# EAGLE schematic iRob_Upsized_ESP32DOIT_Shield v7 (EAGLE 9.7.0)

## Sheet 1 of 2: MCU
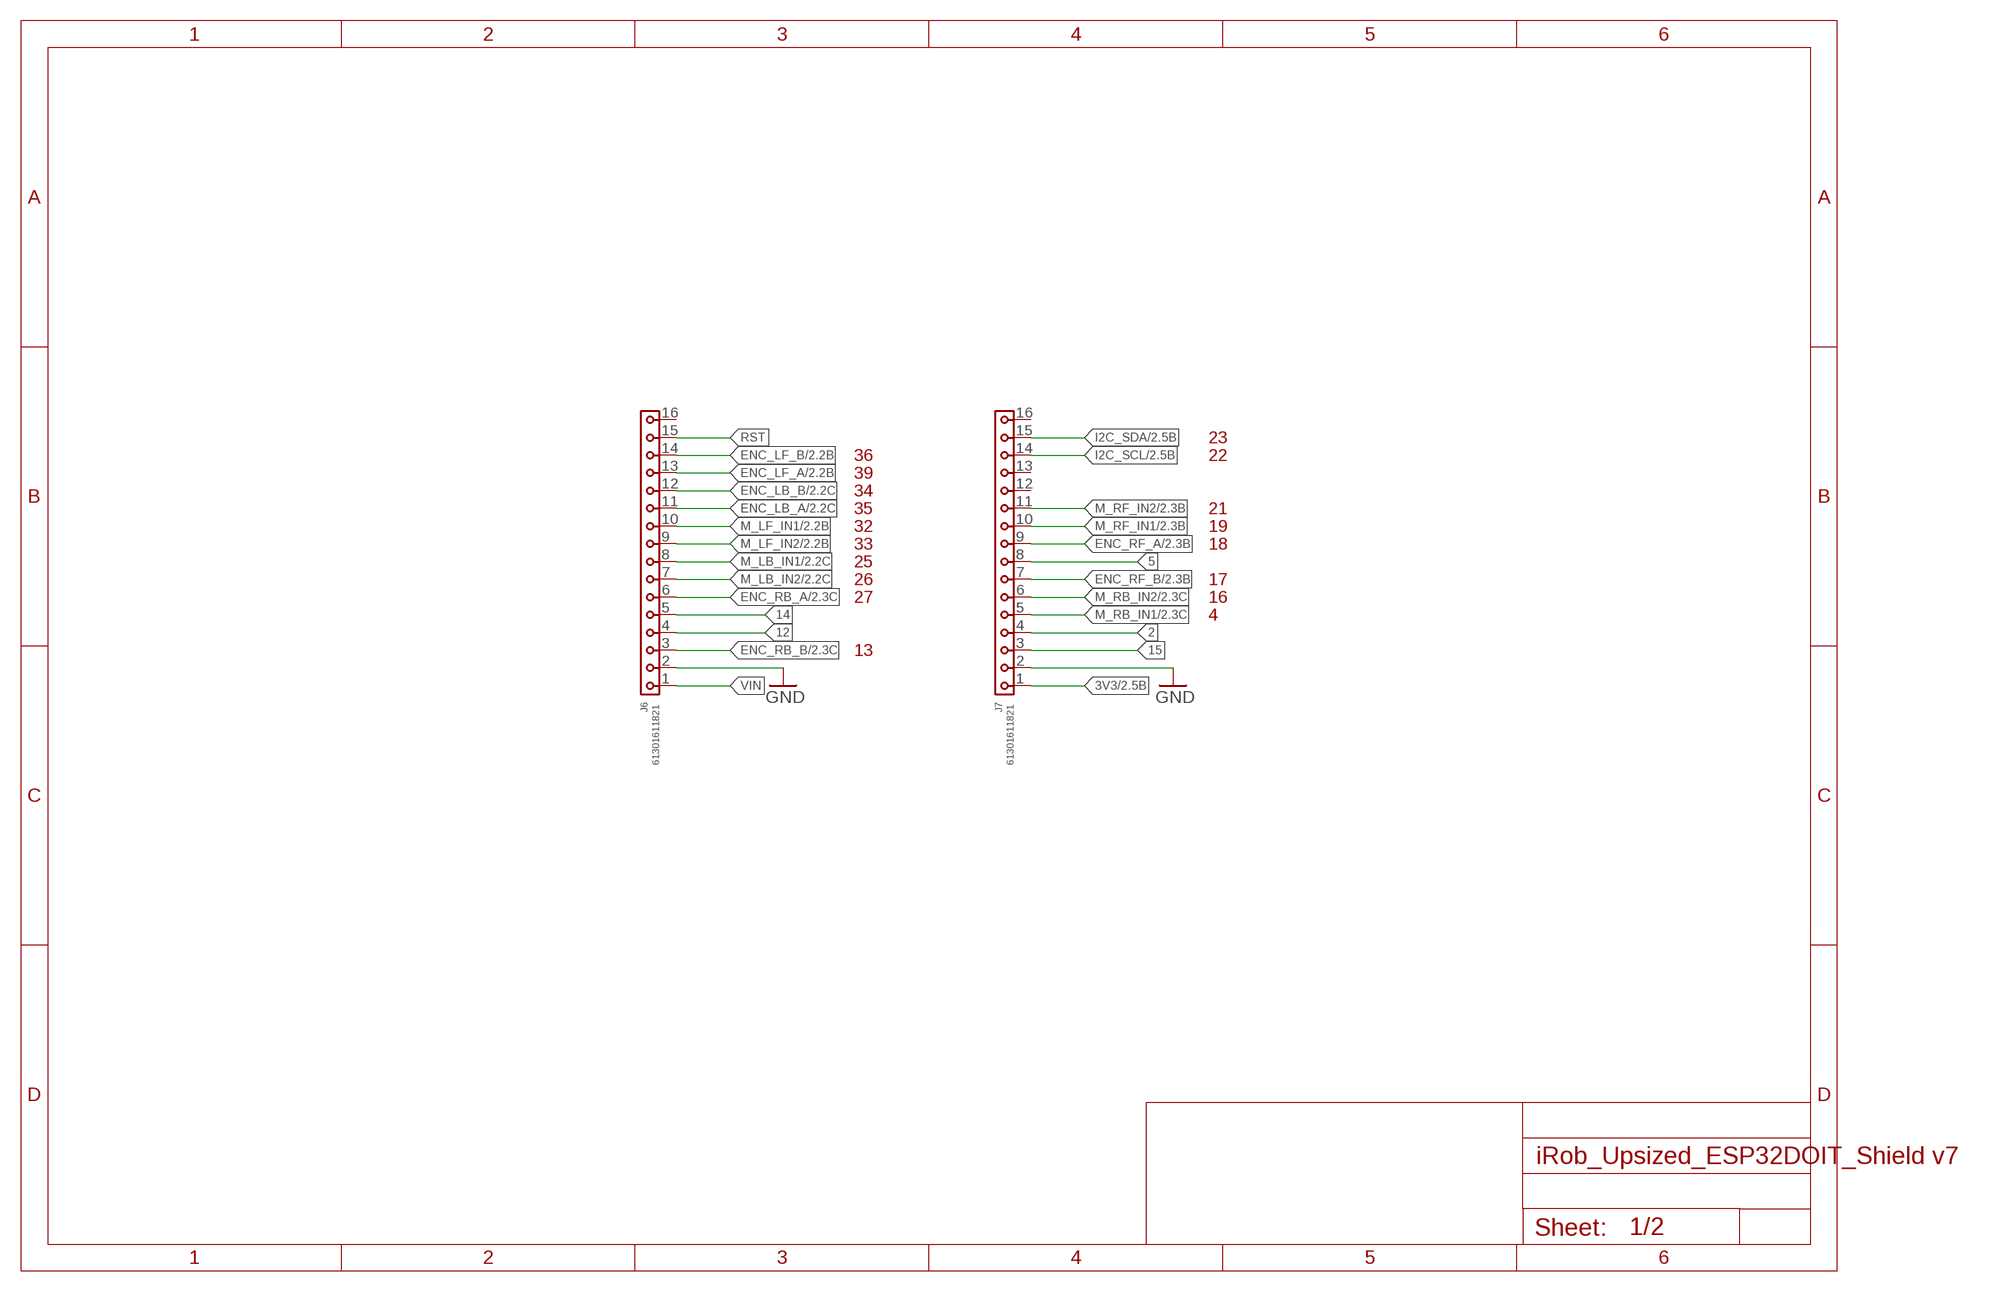
[diagram p0: schematic, sheet 1]

### Parts
J6  61301611821  6130XX11821_61301611821  [61301611821]
J7  61301611821  6130XX11821_61301611821  [61301611821]

### Nets
2: J7.4
3V3: J7.1 ; also sheet 2
5: J7.8
12: J6.4
14: J6.5
15: J7.3
ENC_LB_A: J6.11 ; also sheet 2
ENC_LB_B: J6.12 ; also sheet 2
ENC_LF_A: J6.13 ; also sheet 2
ENC_LF_B: J6.14 ; also sheet 2
ENC_RB_A: J6.6 ; also sheet 2
ENC_RB_B: J6.3 ; also sheet 2
ENC_RF_A: J7.9 ; also sheet 2
ENC_RF_B: J7.7 ; also sheet 2
GND: J6.2 J7.2 ; also sheet 2
I2C_SCL: J7.14 ; also sheet 2
I2C_SDA: J7.15 ; also sheet 2
M_LB_IN1: J6.8 ; also sheet 2
M_LB_IN2: J6.7 ; also sheet 2
M_LF_IN1: J6.10 ; also sheet 2
M_LF_IN2: J6.9 ; also sheet 2
M_RB_IN1: J7.5 ; also sheet 2
M_RB_IN2: J7.6 ; also sheet 2
M_RF_IN1: J7.10 ; also sheet 2
M_RF_IN2: J7.11 ; also sheet 2
RST: J6.15
VIN: J6.1
Unconnected: J6.16 J7.12 J7.13 J7.16

### Notes on the sheet
- 23
- 36 | 22
- 39
- 34
- 35 | 21
- 32 | 19
- 33 | 18
- 25
- 26 | 17
- 27 | 16
- 4
- 13

## Sheet 2 of 2: I/F
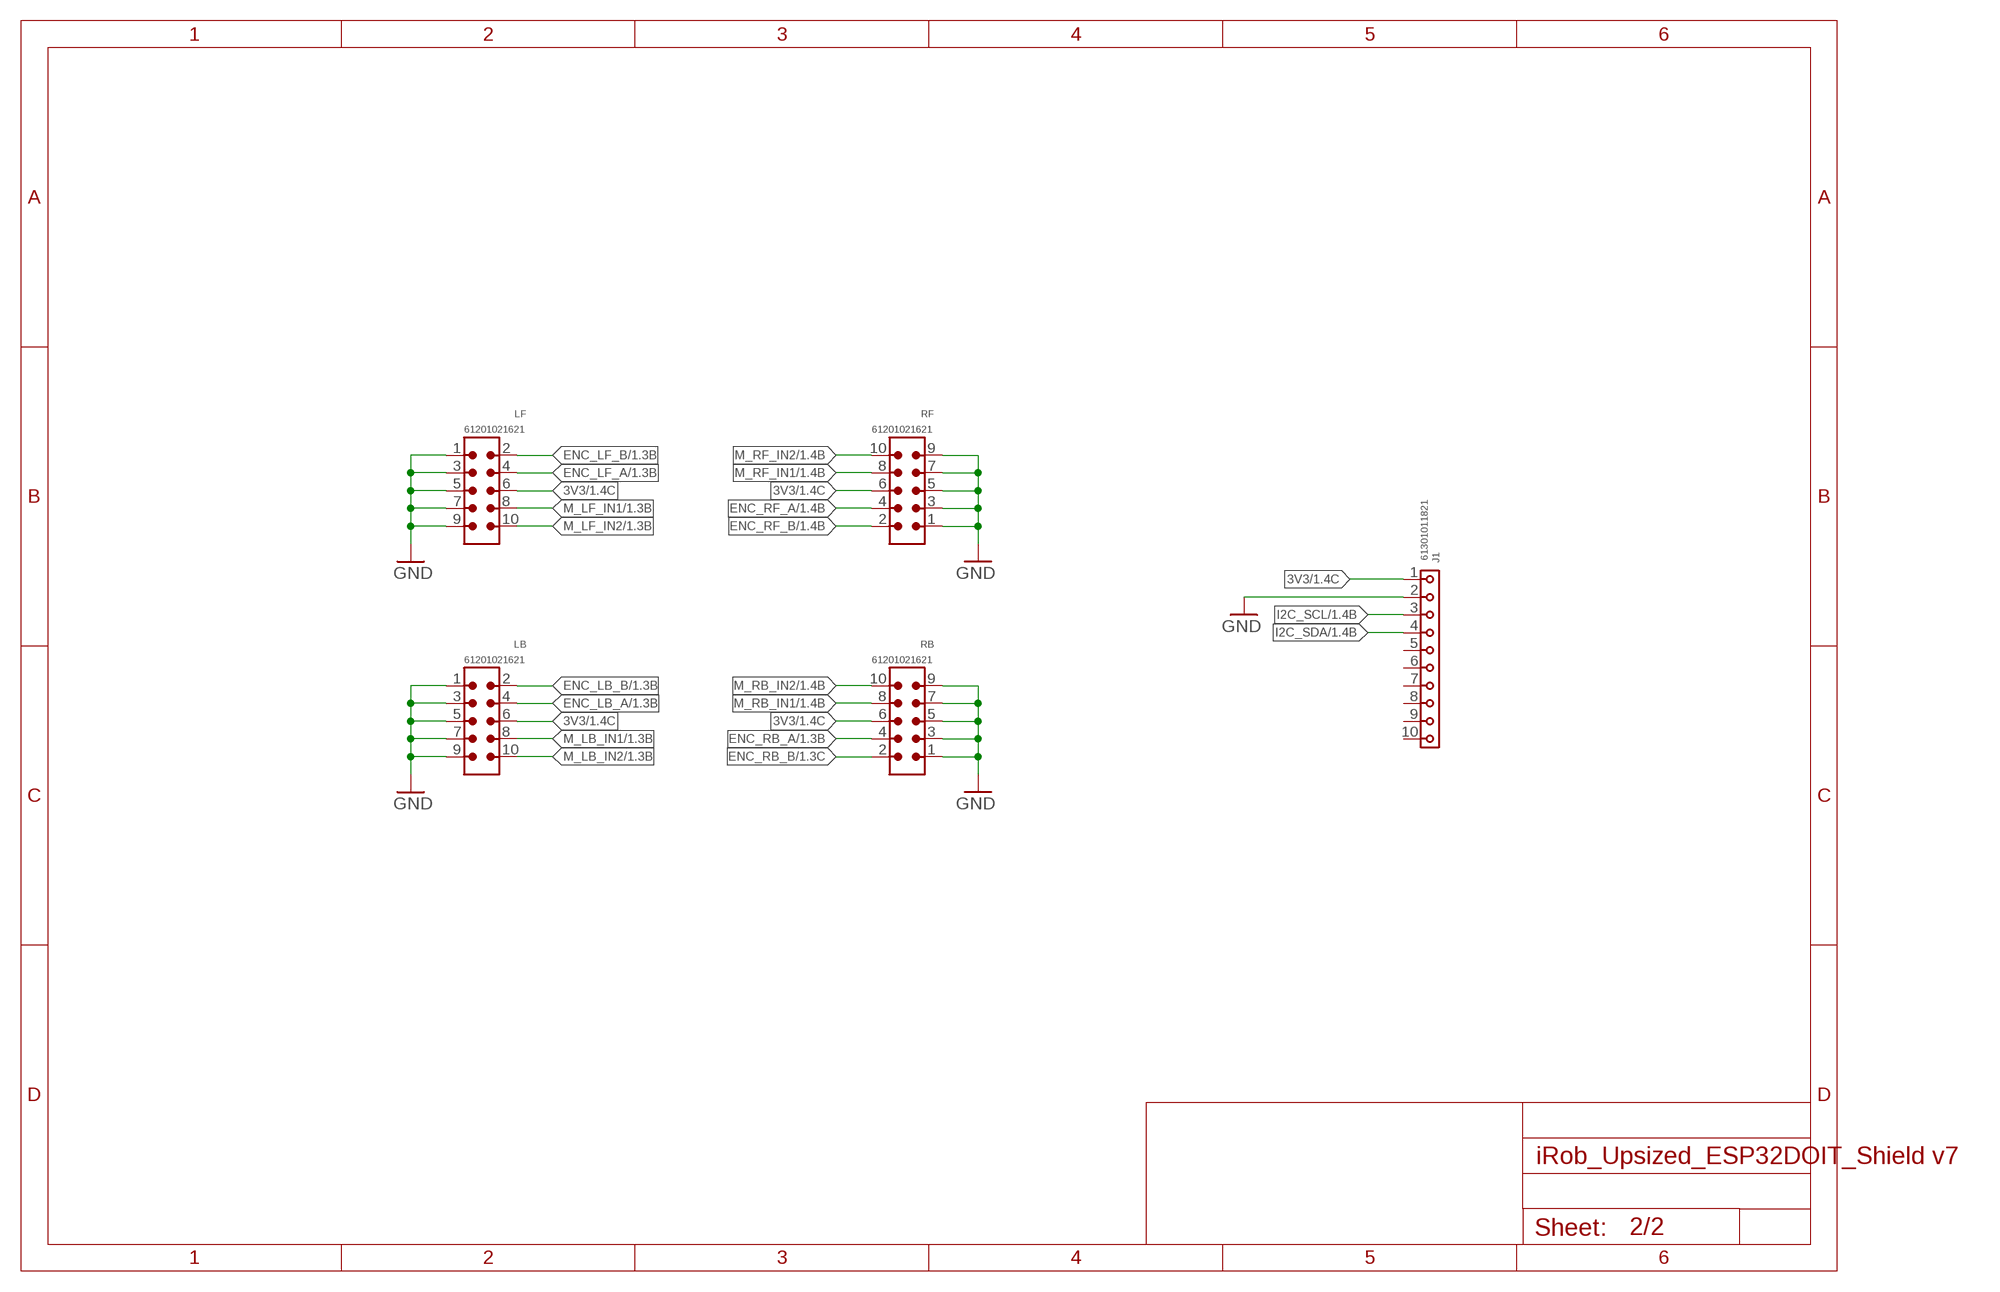
[diagram p1: schematic, sheet 2]

### Parts
J1  61301011821  6130XX11821_61301011821  [61301011821]
LB  61201021621  6120XX21621_61201021621  [61201021621]
LF  61201021621  6120XX21621_61201021621  [61201021621]
RB  61201021621  6120XX21621_61201021621  [61201021621]
RF  61201021621  6120XX21621_61201021621  [61201021621]

### Nets
3V3: J1.1 LB.6 LF.6 RB.6 RF.6 ; also sheet 1
ENC_LB_A: LB.4 ; also sheet 1
ENC_LB_B: LB.2 ; also sheet 1
ENC_LF_A: LF.4 ; also sheet 1
ENC_LF_B: LF.2 ; also sheet 1
ENC_RB_A: RB.4 ; also sheet 1
ENC_RB_B: RB.2 ; also sheet 1
ENC_RF_A: RF.4 ; also sheet 1
ENC_RF_B: RF.2 ; also sheet 1
GND: J1.2 LB.1 LB.3 LB.5 LB.7 LB.9 LF.1 LF.3 LF.5 LF.7 LF.9 RB.1 RB.3 RB.5 RB.7 RB.9 RF.1 RF.3 RF.5 RF.7 RF.9 ; also sheet 1
I2C_SCL: J1.3 ; also sheet 1
I2C_SDA: J1.4 ; also sheet 1
M_LB_IN1: LB.8 ; also sheet 1
M_LB_IN2: LB.10 ; also sheet 1
M_LF_IN1: LF.8 ; also sheet 1
M_LF_IN2: LF.10 ; also sheet 1
M_RB_IN1: RB.8 ; also sheet 1
M_RB_IN2: RB.10 ; also sheet 1
M_RF_IN1: RF.8 ; also sheet 1
M_RF_IN2: RF.10 ; also sheet 1
Unconnected: J1.5 J1.6 J1.7 J1.8 J1.9 J1.10

## Library data of the parts
J1 = Wurth_Connectors_WR-PHD:6130XX11821_61301011821: WR-PHD 2.54 mm Socket Header ARTICLE PROPERTIES: Pins:1;​ 2;​ 3;​ 4;​ 5;​ 6;​ 7;​ 8;​ 9;​ 10;​ 12;​ 13;​ 14;​ 15;​ 16;​ 18;​ 20;​ 22;​ 24;​ 25;​ 32;​ 36;​ 40 KIND PROPERTIES: Pitch：2.54 mm Quality Class:3 as per CECC 75 301-802 Rows：Single Gender：Socket Header;​ Female Type：Straight MATERIAL PROPERTIES: Insulator Material :PBT Insulator Flammability Rating:UL94 V-0 Contact Material:Copper Alloy Contact Plating:Gold Contact Type:Stamped GENERAL INFORMATION Operating Temperature:-40 up to +125 °C Compliance:Lead free / RoHS ELECTRICAL PROPERTIES: Rated Current:3 A IR 1:3 A Withstanding Voltage:500 V (AC) Contact Resistance:20 mΩ RISO:1000 MΩ CERTIFICATION UL Approval:E323964 PACKAGING PROPERTIES Packaging:Tray <https://katalog.we-online.com/media/images/v2/o33218v209%20Family_WR-PHD_613xxx11821.jpg> Details see: https://katalog.we-online.com/en/em/PHD_2_54_SOCKET_HEADER_6130XX11821 Updated by Yingchun,Shan 2019-10-21 2019 (C) Würth Elektronik; DATASHEET-URL: https://www.we-online.com/catalog/datasheet/61301011821.pdf; GENDER: Socket Header; IR: 3A; MOUNT: THT; PACKAGING: Tray; PART-NUMBER: 61301011821; PINS: 10; PITCH: 2.54mm; ROWS: Single; TYPE: Straight
J6 J7 = Wurth_Connectors_WR-PHD:6130XX11821_61301611821: WR-PHD 2.54 mm Socket Header ARTICLE PROPERTIES: Pins:1;​ 2;​ 3;​ 4;​ 5;​ 6;​ 7;​ 8;​ 9;​ 10;​ 12;​ 13;​ 14;​ 15;​ 16;​ 18;​ 20;​ 22;​ 24;​ 25;​ 32;​ 36;​ 40 KIND PROPERTIES: Pitch：2.54 mm Quality Class:3 as per CECC 75 301-802 Rows：Single Gender：Socket Header;​ Female Type：Straight MATERIAL PROPERTIES: Insulator Material :PBT Insulator Flammability Rating:UL94 V-0 Contact Material:Copper Alloy Contact Plating:Gold Contact Type:Stamped GENERAL INFORMATION Operating Temperature:-40 up to +125 °C Compliance:Lead free / RoHS ELECTRICAL PROPERTIES: Rated Current:3 A IR 1:3 A Withstanding Voltage:500 V (AC) Contact Resistance:20 mΩ RISO:1000 MΩ CERTIFICATION UL Approval:E323964 PACKAGING PROPERTIES Packaging:Tray <https://katalog.we-online.com/media/images/v2/o33218v209%20Family_WR-PHD_613xxx11821.jpg> Details see: https://katalog.we-online.com/en/em/PHD_2_54_SOCKET_HEADER_6130XX11821 Updated by Yingchun,Shan 2019-10-21 2019 (C) Würth Elektronik; DATASHEET-URL: https://www.we-online.com/catalog/datasheet/61301611821.pdf; GENDER: Socket Header; IR: 3A; MOUNT: THT; PACKAGING: Tray; PART-NUMBER: 61301611821; PINS: 16; PITCH: 2.54mm; ROWS: Single; TYPE: Straight
LB LF RB RF = Wurth_Connectors_WR-BHD:6120XX21621_61201021621: WR-BHD 2.54 mm Male Box Header KIND PROPERTIES: Pitch 2.54 mm Gender:Male MATERIAL PROPERTIES: Insulator Material:PBT Insulator Flammability Rating UL94 V-0 Insulator Color:Black Contact Material :Copper Alloy Contact Plating :Gold Contact Type: Stamped GENERAL INFORMATION: Operating Temperature:-40 °C up to +125 °C Compliance:RoHS Working Voltage: 250 V (AC) Withstanding Voltage:500 V (AC) Contact Resistance: 20 mΩ Insulation Resistance:1000 MΩ CERTIFICATION: UL Approval:E323964 PACKAGING PROPERTIES Packaging :Tray <https://www.we-online.com/catalog/media/o32884v209%20Family_WR-BHD_6120xx21621.jpg> Details see: https://www.we-online.com/catalog/en/BHD_2_54_MALE_BOX_HEADER_6120XX21621 Updated by Ella Wu 2021-3-12 2021 (C) Würth Elektronik; CONTACT-RESISTANCE: 20mOhm; DATASHEET-URL: https://www.we-online.com/catalog/datasheet/61201021621.pdf; GENDER: Male; IR: 3A; LENGTH: 20.36mm; MOUNT: THT; PACKAGING: Tray; PART-NUMBER: 61201021621; PINS: 10; PITCH: 2.54mm; TYPE: Straight; WORKING-VOLTAGE: 250V(AC)